# Altium schematic sheet EPCU.SchDoc
size A2
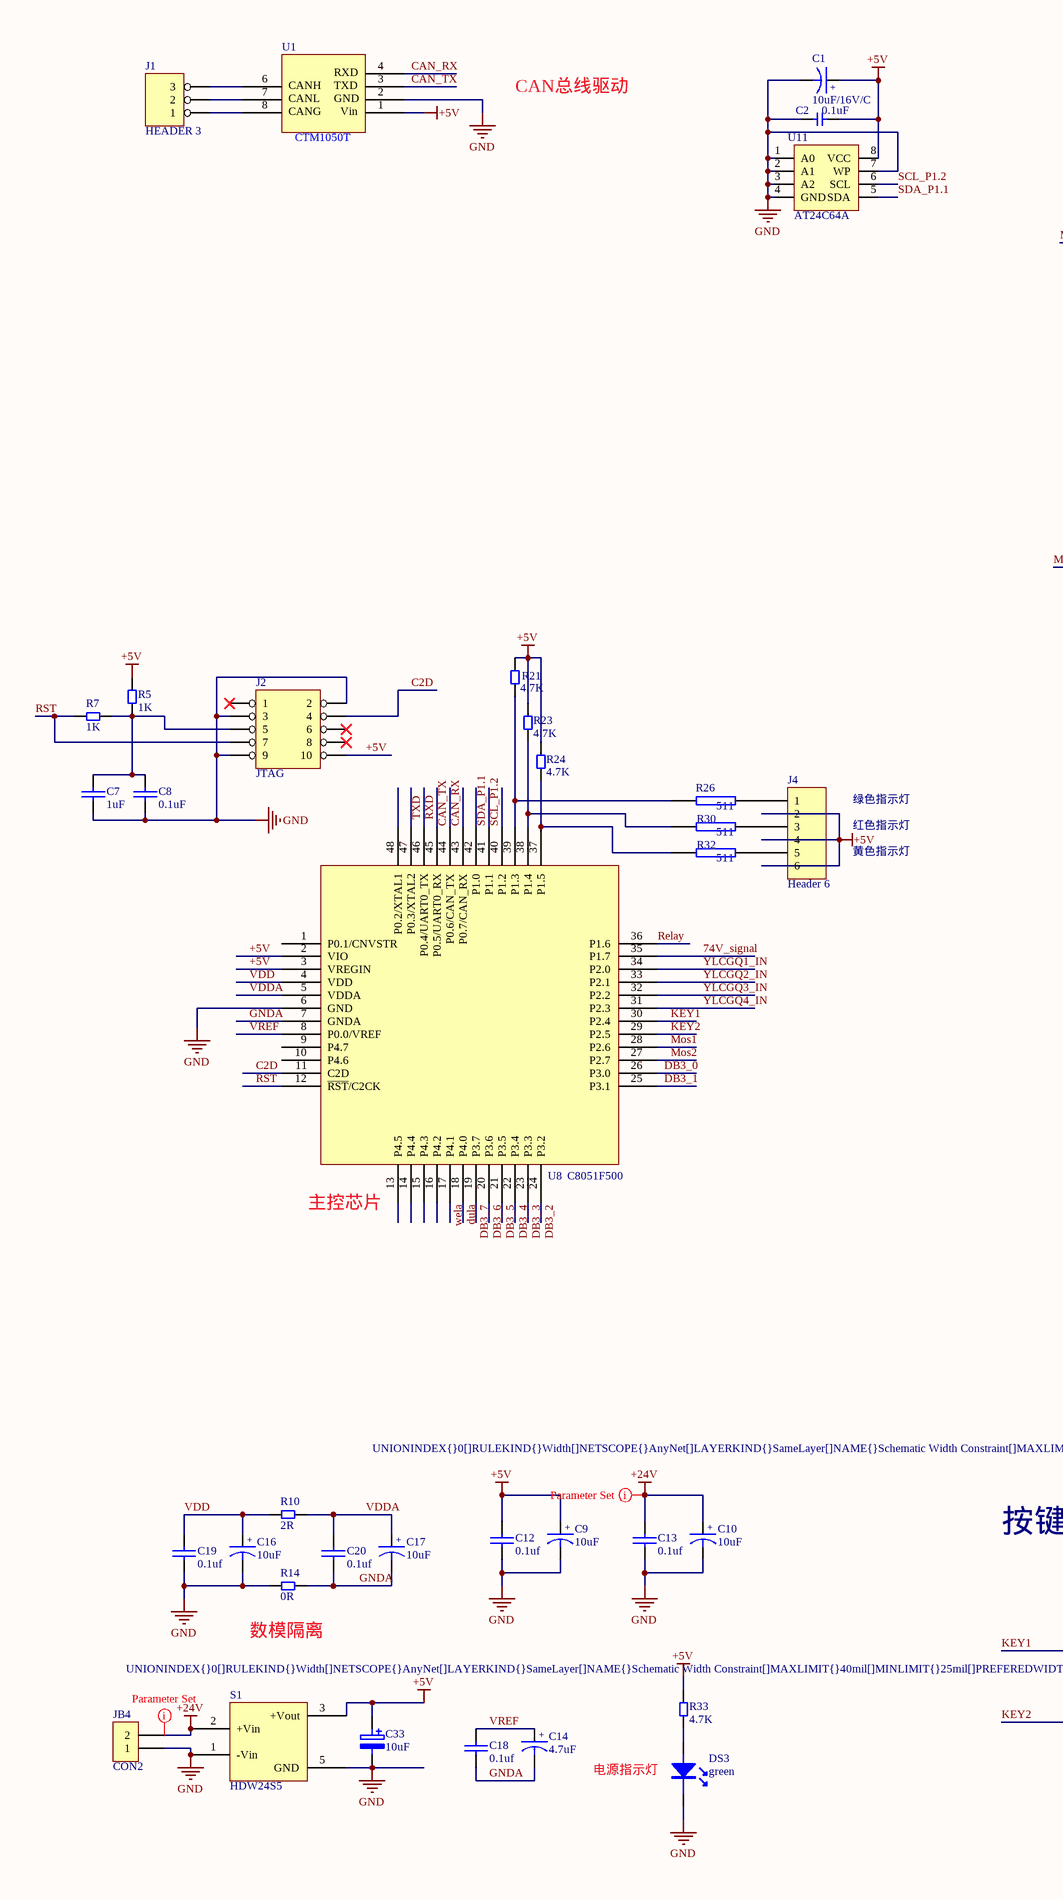
[diagram p0: EPCU.SchDoc, left]
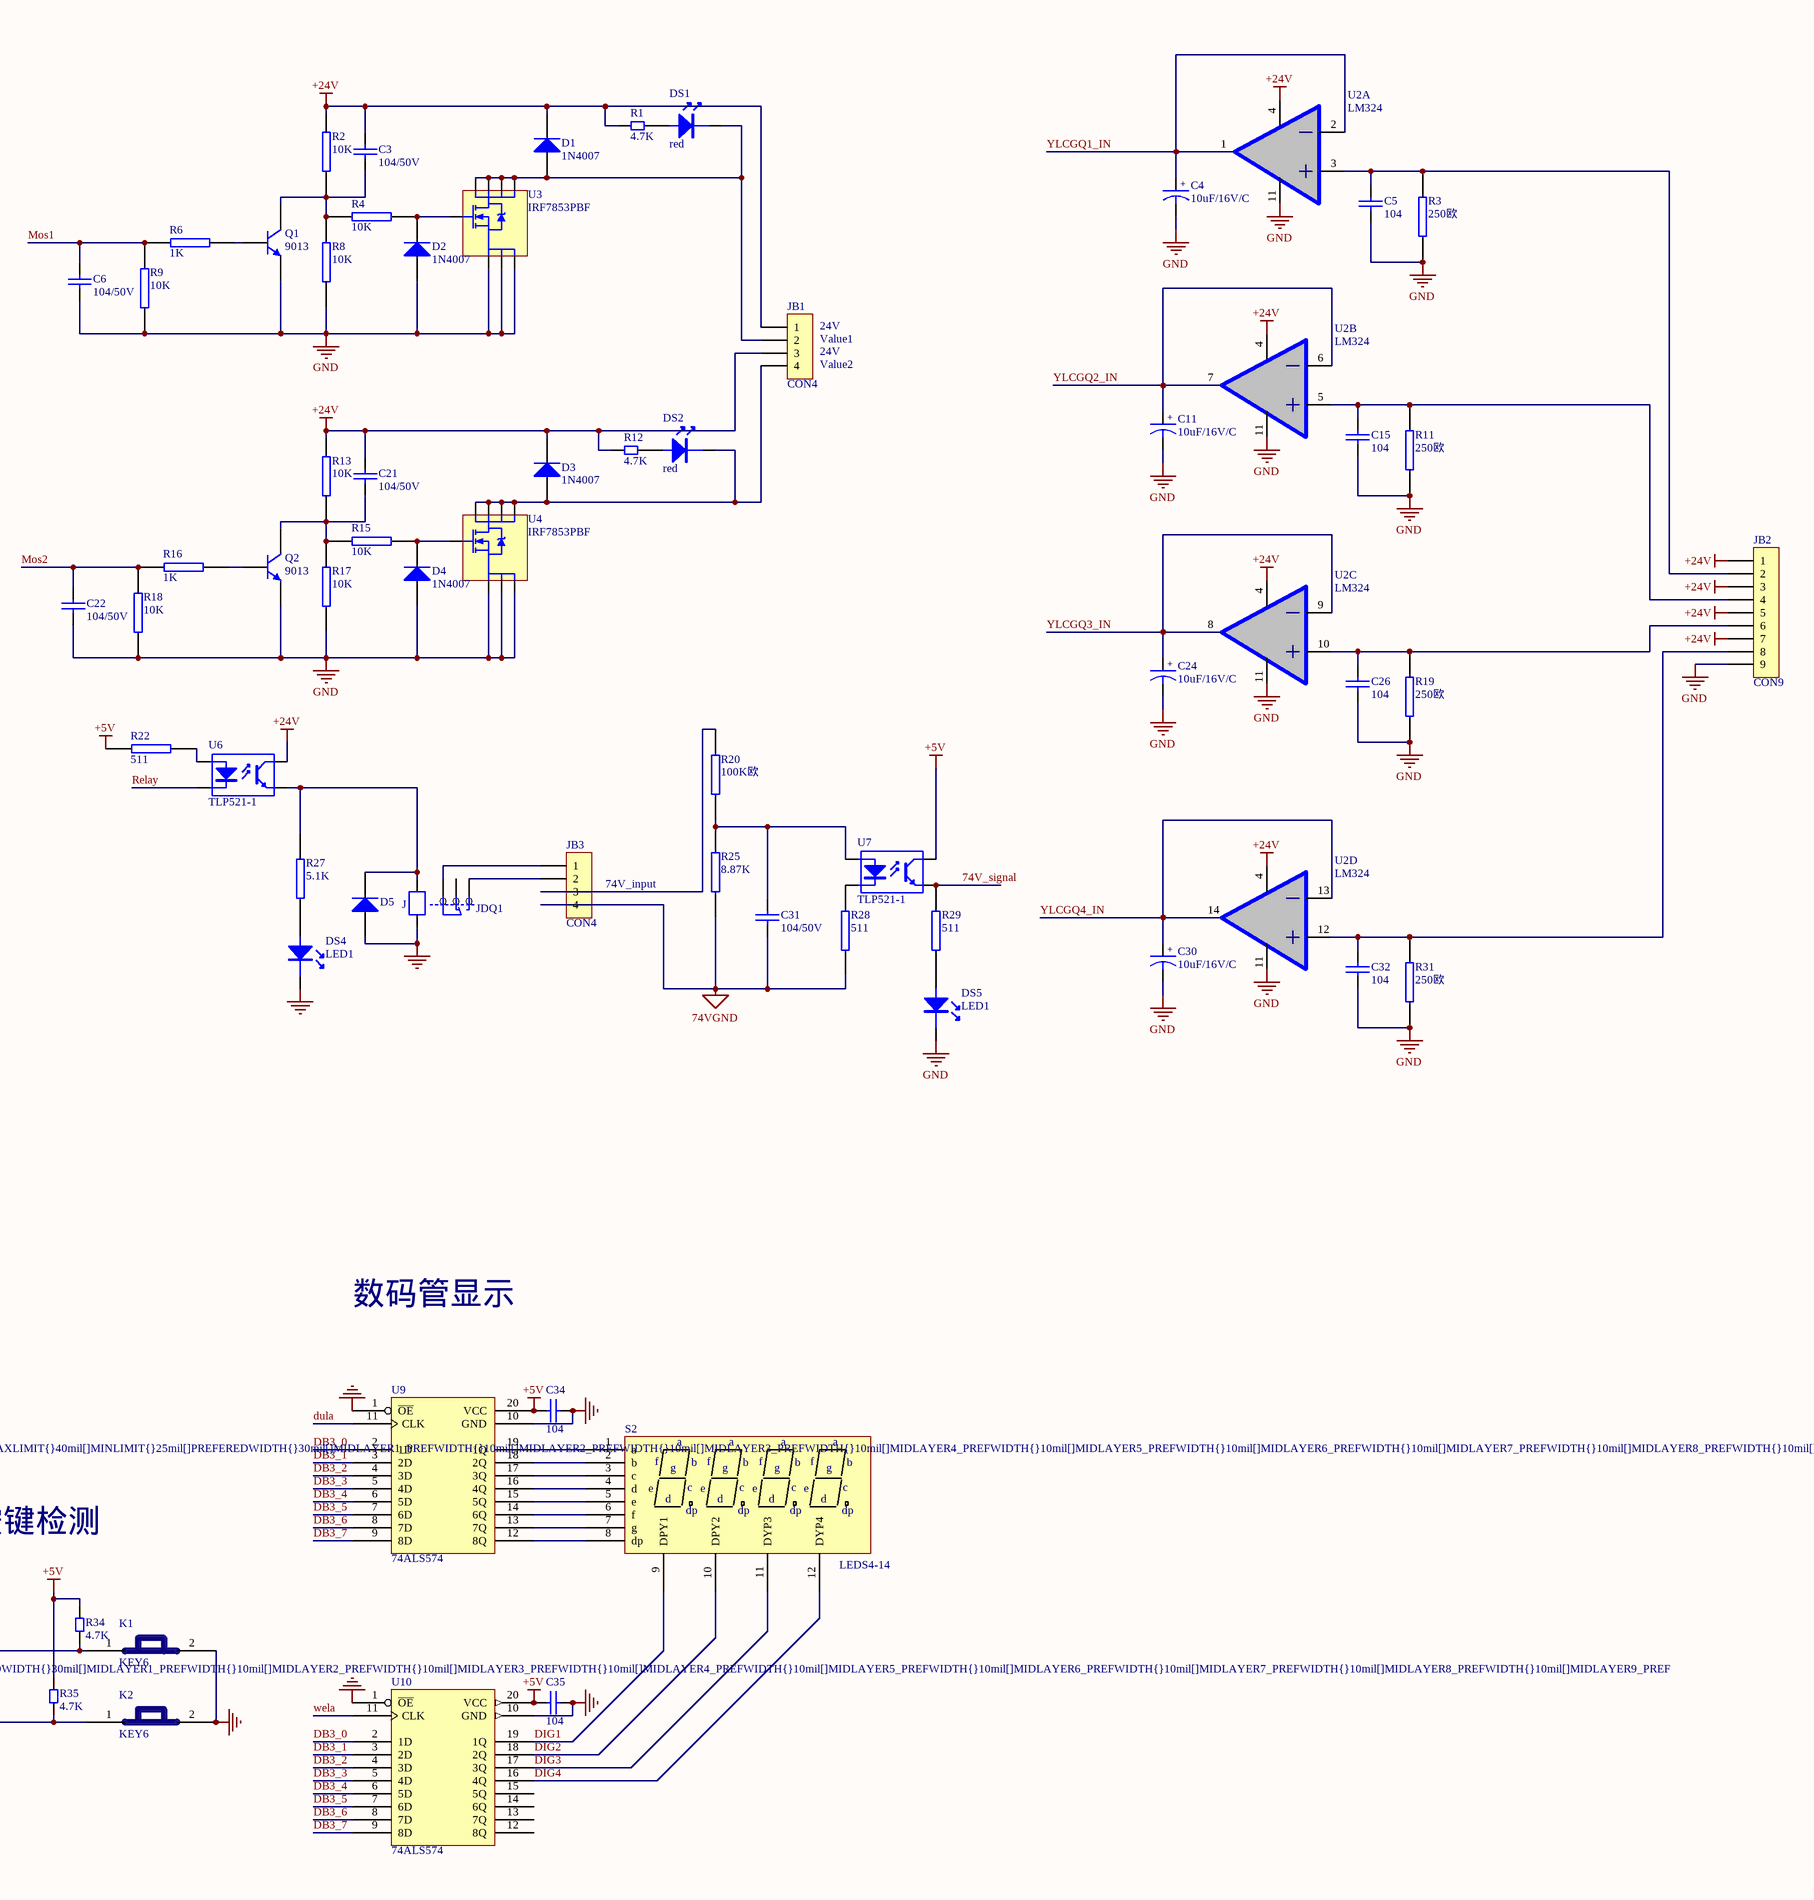
[diagram p1: EPCU.SchDoc, right]

## Parts
C1  10uF/16V/C  [106E]
C2  0.1uF  [0805]
C3  104/50V  [0805]
C4  10uF/16V/C  [106E]
C5  104  [0805]
C6  104/50V  [0805]
C7  1uF  [0805]
C8  0.1uF  [0805]
C9  10uF  [106E]
C10  10uF  [106E]
C11  10uF/16V/C  [106E]
C12  0.1uf  [0805]
C13  0.1uf  [0805]
C14  4.7uF  [106E]
C15  104  [0805]
C16  10uF  [106E]
C17  10uF  [106E]
C18  0.1uf  [0805]
C19  0.1uf  [0805]
C20  0.1uf  [0805]
C21  104/50V  [0805]
C22  104/50V  [0805]
C24  10uF/16V/C  [106E]
C26  104  [0805]
C30  10uF/16V/C  [106E]
C31  104/50V  [0805]
C32  104  [0805]
C33  10uF  [RB.2/.4]
C34  104  [0805]
C35  104  [0805]
D1  1N4007  [DO-41]
D2  1N4007  [DO-41]
D3  1N4007  [DO-41]
D4  1N4007  [DO-41]
D5  Diode 1N4001  [DO-41]  (value not drawn)
DS1  red  [1206DIODE]
DS2  red  [1206DIODE]
DS3  green  [1206DIODE]
DS4  LED1  [1206DIODE]
DS5  LED1  [1206DIODE]
J1  HEADER 3  [254-3]
J2  JTAG  [DC3-10P]
J4  Header 6  [HDR1X6]
JB1  CON4  [SIP4]
JB2  CON9  [SIP9]
JB3  CON4  [SIP4]
JB4  CON2  [POWER2]
JDQ1  RELAY  [jidianqi_12VDC]  (value not drawn)
K1  KEY6  [KEY6]
K2  KEY6  [KEY6]
Q1  9013  [TO-226-AA]
Q2  9013  [TO-226-AA]
R1  4.7K  [0805]
R2  10K  [0805]
R3  250欧  [AXIAL0.4]
R4  10K  [0805]
R5  1K  [0805]
R6  1K  [0805]
R7  1K  [0805]
R8  10K  [0805]
R9  10K  [0805]
R10  2R  [0805]
R11  250欧  [AXIAL0.4]
R12  4.7K  [0805]
R13  10K  [0805]
R14  0R  [0805]
R15  10K  [0805]
R16  1K  [0805]
R17  10K  [0805]
R18  10K  [0805]
R19  250欧  [AXIAL0.4]
R20  100K欧  [AXIAL0.4]
R21  4.7K  [0805]
R22  511  [0805]
R23  4.7K  [0805]
R24  4.7K  [0805]
R25  8.87K  [AXIAL0.4]
R26  511  [0805]
R27  5.1K  [0805]
R28  511  [0805]
R29  511  [1206DIODE]
R30  511  [0805]
R31  250欧  [AXIAL0.4]
R32  511  [0805]
R33  4.7K  [0805]
R34  4.7K  [0805]
R35  4.7K  [0805]
S1  HDW24S5  [HDW24S5]
S2  LEDS4-14  [LEDS4-14]
U1  (no value)  [CYM1050T]
U2  LM324  [lm324]  (parts A,B,C,D of 4)
U3  IRF7853PBF  [SOP-8]
U4  IRF7853PBF  [SO-8]
U6  TLP521-1  [TLP521-1]
U7  TLP521-1  [TLP521-1]
U8  C8051F500  [TQFP-48]
U9  74ALS574  [SOL-20]
U10  74ALS574  [SOL-20]
U11  AT24C64A  [SO-8]

## Nets
74VGND: C31.2 JB3.4 R25.1 R28.2
+5V: C1.1 C2.2 C9.1 C12.2 C33.1 C34.1 C35.1 J2.10 J4.2 J4.4 J4.6 R5.1 R21.2 R22.2 R23.1 R24.1 R33.1 R34.1 R35.2 S1.3(+Vout) U1.1 U7.4(C) U8.2(VIO) U8.3(VREGIN) U9.20(VCC) U10.20(VCC) U11.8(VCC)
+24V: C3.1 C10.1 C13.2 C21.1 D1.2(K) D3.2(K) JB1.1 JB1.3 JB2.1 JB2.3 JB2.5 JB2.7 JB4.2 R1.2 R2.2 R12.2 R13.2 S1.2(+Vin) U2.4 U6.4(C)
GND: C1.2 C2.1 C4.2 C5.2 C6.2 C7.1 C8.1 C9.2 C10.2 C11.2 C12.1 C13.1 C15.2 C16.2 C19.1 C22.2 C24.2 C26.2 C30.2 C32.2 C33.2 C34.2 C35.2 D2.1(A) D4.1(A) D5.1(A) DS3.2(K) DS4.2(K) DS5.2(K) J2.2 J2.3 J2.9 JB2.9 JB4.1 JDQ1.2 K1.2 K2.2 Q1.1(E) Q2.1(E) R3.2 R8.1 R9.1 R11.2 R14.2 R17.1 R18.1 R19.2 R31.2 S1.1(-Vin) S1.5(GND) U1.2 U2.11 U3.1(S) U3.2(S) U3.3(S) U4.1(S) U4.2(S) U4.3(S) U8.6(GND) U9.1(~{OE}) U9.10(GND) U10.1(~{OE}) U10.10(GND) U11.1(A0) U11.2(A1) U11.3(A2) U11.4(GND) U11.7(WP)
74V_signal: R29.2 U7.3(E) U8.35(P1.7)
C2D: J2.4 U8.11(C2D)
CAN_RX: U1.4 U8.43(P0.7/CAN_RX)
CAN_TX: U1.3 U8.44(P0.6/CAN_TX)
DB3_0: U8.26(P3.0) U9.2(1D) U10.2(1D)
DB3_1: U8.25(P3.1) U9.3(2D) U10.3(2D)
DB3_2: U8.24(P3.2) U9.4(3D) U10.4(3D)
DB3_3: U8.23(P3.3) U9.5(4D) U10.5(4D)
DB3_4: U8.22(P3.4) U9.6(5D) U10.6(5D)
DB3_5: U8.21(P3.5) U9.7(6D) U10.7(6D)
DB3_6: U8.20(P3.6) U9.8(7D) U10.8(7D)
DB3_7: U8.19(P3.7) U9.9(8D) U10.9(8D)
DIG1: S2.9(DPY1) U10.19(1Q)
DIG2: S2.10(DPY2) U10.18(2Q)
DIG3: S2.11(DYP3) U10.17(3Q)
DIG4: S2.12(DYP4) U10.16(4Q)
dula: U8.18(P4.0) U9.11(CLK)
GNDA: C14.2 C17.2 C18.1 C20.1 R14.1 U8.7(GNDA)
KEY1: K1.1 R34.2 U8.30(P2.4)
KEY2: K2.1 R35.1 U8.29(P2.5)
Mos1: C6.1 R6.1 R9.2 U8.28(P2.6)
Mos2: C22.1 R16.1 R18.2 U8.27(P2.7)
Relay: U6.2(K) U8.36(P1.6)
RST: J2.7 R7.2 U8.12(~{RST}/C2CK)
RXD: U8.45(P0.5/UART0_RX)
SCL_P1.2: U8.40(P1.2) U11.6(SCL)
SDA_P1.1: U8.41(P1.1) U11.5(SDA)
TXD: U8.46(P0.4/UART0_TX)
VDD: C16.1 C19.2 R10.2 U8.4(VDD)
VDDA: C17.1 C20.2 R10.1 U8.5(VDDA)
VREF: C14.1 C18.2 U8.8(P0.0/VREF)
wela: U8.17(P4.1) U10.11(CLK)
YLCGQ1_IN: C4.1 U2.1 U2.2 U8.34(P2.0)
YLCGQ2_IN: C11.1 U2.6 U2.7 U8.33(P2.1)
YLCGQ3_IN: C24.1 U2.8 U2.9 U8.32(P2.2)
YLCGQ4_IN: C30.1 U2.13 U2.14 U8.31(P2.3)
NetC3_2: C3.2 Q1.3(C) R2.1 R4.2 R8.2
NetC5_1: C5.1 JB2.2 R3.1 U2.3
NetC7_2: C7.2 C8.2 J2.5 R5.2 R7.1
NetC15_1: C15.1 JB2.4 R11.1 U2.5
NetC21_2: C21.2 Q2.3(C) R13.1 R15.2 R17.2
NetC26_1: C26.1 JB2.6 R19.1 U2.10
NetC31_1: C31.1 R20.1 R25.2 U7.1(A)
NetC32_1: C32.1 JB2.8 R31.1 U2.12
NetD1_1: D1.1(A) DS1.2(K) JB1.2 U3.5(D) U3.6(D) U3.7(D) U3.8(D)
NetD2_2: D2.2(K) R4.1 U3.4(G)
NetD3_1: D3.1(A) DS2.2(K) JB1.4 U4.5(D) U4.6(D) U4.7(D) U4.8(D)
NetD4_2: D4.2(K) R15.1 U4.4(G)
NetD5_2: D5.2(K) JDQ1.5 R27.2 U6.3(E)
NetDS1_1: DS1.1(A) R1.1
NetDS2_1: DS2.1(A) R12.1
NetDS3_1: DS3.1(A) R33.2
NetDS4_1: DS4.1(A) R27.1
NetDS5_1: DS5.1(A) R29.1
NetJ1_1: J1.1 U1.8
NetJ1_2: J1.2 U1.7
NetJ1_3: J1.3 U1.6
NetJ4_1: J4.1 R26.1
NetJ4_3: J4.3 R30.1
NetJ4_5: J4.5 R32.1
NetJB3_1: JB3.1 JDQ1.1
NetJB3_2: JB3.2 JDQ1.3
NetJB3_3: JB3.3 R20.2
NetQ1_2: Q1.2(B) R6.2
NetQ2_2: Q2.2(B) R16.2
NetR21_1: R21.1 R26.2 U8.39(P1.3)
NetR22_1: R22.1 U6.1(A)
NetR23_2: R23.2 R30.2 U8.38(P1.4)
NetR24_2: R24.2 R32.2 U8.37(P1.5)
NetR28_1: R28.1 U7.2(K)
NetS2_1: S2.1(a) U9.19(1Q)
NetS2_2: S2.2(b) U9.18(2Q)
NetS2_3: S2.3(c) U9.17(3Q)
NetS2_4: S2.4(d) U9.16(4Q)
NetS2_5: S2.5(e) U9.15(5Q)
NetS2_6: S2.6(f) U9.14(6Q)
NetS2_7: S2.7(g) U9.13(7Q)
NetS2_8: S2.8(dp) U9.12(8Q)

Not connected (* = marked no-connect by the designer): J2 1* 6* 8*; JDQ1 4; U8 1(P0.1/CNVSTR) 9(P4.7) 10(P4.6) 13(P4.5) 14(P4.4) 15(P4.3) 16(P4.2) 42(P1.0) 47(P0.3/XTAL2) 48(P0.2/XTAL1); U10 12(8Q) 13(7Q) 14(6Q) 15(5Q)

## Layout directives
rule Width Constraint [Pref Width = 30mil    Min Width = 25mil    Max Width = 40mil]: +24V

## Notes on the sheet
- CAN总线驱动
- (near JB1) 24V
- (near JB1) Value1
- (near JB1) Value2
- 绿色指示灯
- 红色指示灯
- 黄色指示灯
- 74V_input
- (near U8) 主控芯片
- 数码管显示
- 按键检测
- (near R14) 数模隔离
- (near DS3) 电源指示灯
- (in symbol CAPACITOR POL) +
- (in symbol CTM1050T) RXD; CANH; TXD; CANL; GND; CANG; Vin
- (in symbol RELAY) J

## Library data of the parts
C1 C4 C9-C11 C14 C16 C17 C24 C30 = CAPACITOR POL: Capacitor
C2 = CAP_S
C3 C5-C8 C12 C13 C15 C18-C22 C26 C31 C32 C34 C35 = CAP: Capacitor
C33 = Pro12.tmp_22uF_5
D1-D4 = Diode 1N4007: 1 Amp General Purpose Rectifier; Published: 8-Jun-2000; LatestRevisionDate: 17-Jul-2002; LatestRevisionNote: Re-released for DXP Platform.; DatasheetVersion: 1998; PackageVersion: Aug-1999; PackageReference: DO-41; Publisher: Altium Limited; PackageDescription: Diode, Axial; Body 5.2 x 2.7 mm (LxDia. max), Lead Dia. 0.86 mm (max); Code_JEDEC: DO-204-AL; ComponentLink1Description: Manufacturer Link; ComponentLink1URL: http://www.fairchildsemi.com/; ComponentLink2Description: Datasheet; ComponentLink2URL: http://www.fairchildsemi.com/ds/1N%2F1N4001.pdf
D5 = Diode 1N4001: 1 Amp General Purpose Rectifier; Published: 8-Jun-2000; LatestRevisionDate: 17-Jul-2002; LatestRevisionNote: Re-released for DXP Platform.; DatasheetVersion: 1998; PackageVersion: Aug-1999; PackageReference: DO-41; Publisher: Altium Limited; PackageDescription: Diode, Axial; Body 5.2 x 2.7 mm (LxDia. max), Lead Dia. 0.86 mm (max); Code_JEDEC: DO-204-AL; ComponentLink1Description: Manufacturer Link; ComponentLink1URL: http://www.fairchildsemi.com/; ComponentLink2Description: Datasheet; ComponentLink2URL: http://www.fairchildsemi.com/ds/1N%2F1N4001.pdf
DS1-DS3 = LED
DS4 DS5 = LED: 1206
J2 = HEADER 5X2
J4 = Header 6: Header, 6-Pin; LatestRevisionDate: 17-Jul-2002; LatestRevisionNote: Re-released for DXP Platform.; Publisher: Altium Limited
JB1 JB3 = CON4: zhijiao
JB2 = CON9: connector
Q1 Q2 = NPN: NPN Bipolar Transistor; Published: 8-Jun-2000; LatestRevisionDate: 17-Jul-2002; LatestRevisionNote: Re-released for DXP Platform.; PackageReference: TO-226-AA; Publisher: Altium Limited; PackageDescription: TO, Flat Index; 3 In-Line, Axial Leads; Body Dia. 4.8mm; Leads 0.55 x 0.51 mm (max); Code_JEDEC: TO-226-AA
R1 R5 R7 R10 R12 R14 R21 R23 R24 R33-R35 = RES-S
R2-R4 R6 R8 R9 R11 R13 R15-R20 R22 R25-R32 = RES2
U1 = CTM1050T
U8 = C8051F500/1/4/5
U11 = AT24CXXA